# Altium schematic sheet SoundChip.SchDoc
size A
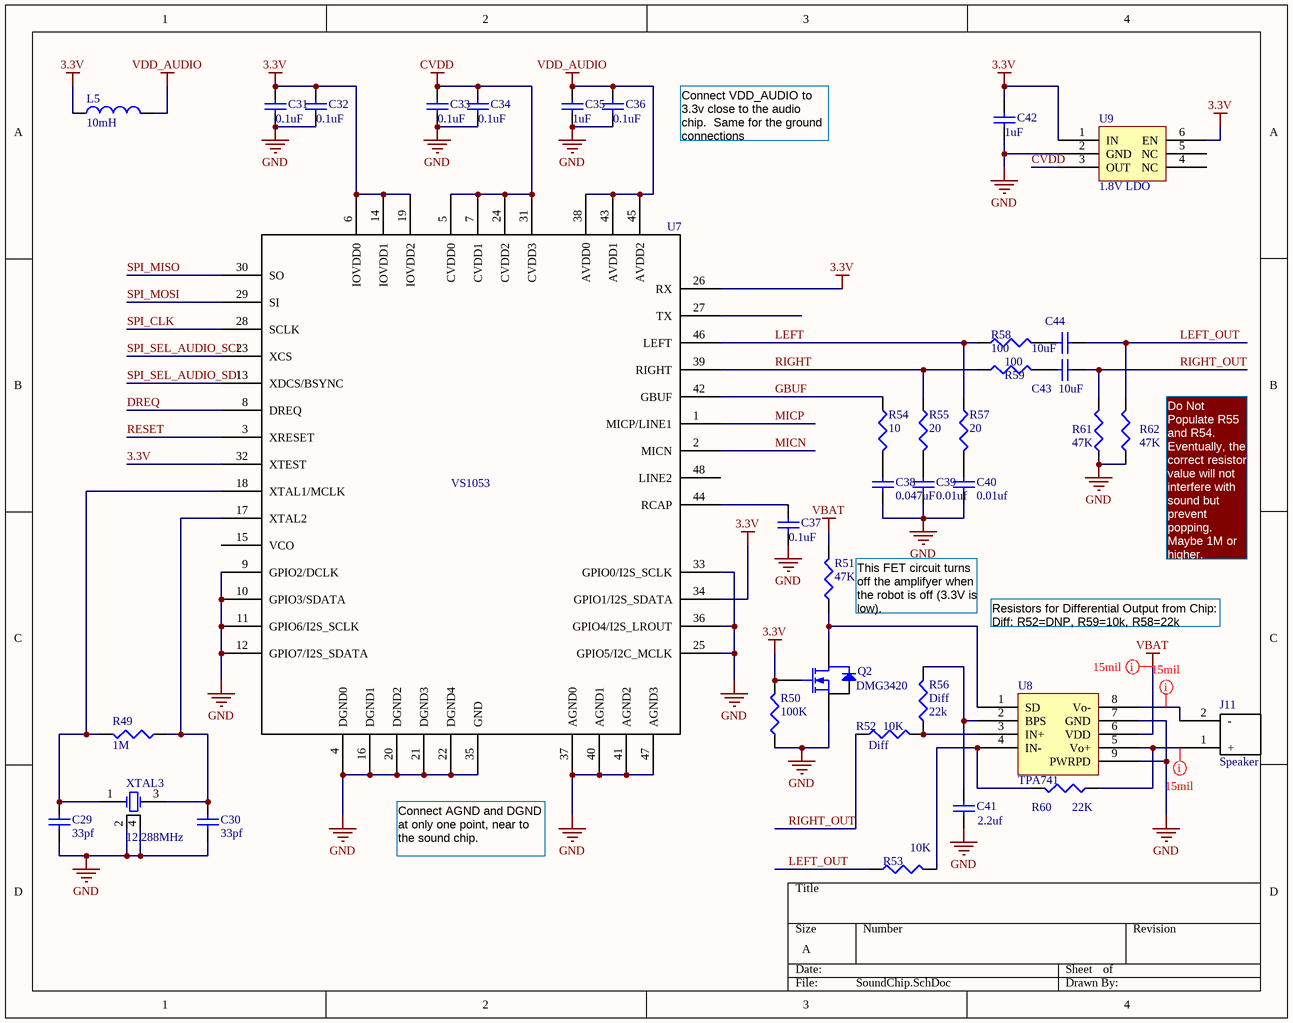
[diagram p0: SoundChip.SchDoc]

## Parts
C29  value 33pf  [CAPC1005L]  (hidden comment: Cap Semi)
C30  value 33pf  [CAPC1005L]  (hidden comment: Cap Semi)
C31  value 0.1uF  [CAPC1005L]  (hidden comment: Cap Semi)
C32  value 0.1uF  [CAPC1005L]  (hidden comment: Cap Semi)
C33  value 0.1uF  [CAPC1005L]  (hidden comment: Cap Semi)
C34  value 0.1uF  [CAPC1005L]  (hidden comment: Cap Semi)
C35  value 1uF  [CAPC1608L]  (hidden comment: Cap Semi)
C36  value 0.1uF  [CAPC1005L]  (hidden comment: Cap Semi)
C37  value 0.1uF  [CAPC1005L]  (hidden comment: Cap Semi)
C38  value 0.047uF  [CAPC1005L]  (hidden comment: Cap Semi)
C39  value 0.01uf  [CAPC1005L]  (hidden comment: Cap Semi)
C40  value 0.01uf  [CAPC1005L]  (hidden comment: Cap Semi)
C41  value 2.2uf  [J1-0603]  (hidden comment: Cap Semi)
C42  value 1uF  [CAPC1608L]  (hidden comment: Cap Semi)
C43  value 10uF  [CAPC1608L]  (hidden comment: Cap Semi)
C44  value 10uF  [CAPC1608L]  (hidden comment: Cap Semi)
J11  Speaker  [BatteryConnJST]
L5  value 10mH  [INDC2012L]  (hidden comment: Inductor)
Q2  MPN: DMG3420  [SOT-23]  (hidden comment: N-Mosfet)
R49  value 1M  [RESC1608L]  (hidden comment: Res3)
R50  value 100K  [RESC1608L]  (hidden comment: Res3)
R51  value 47K  [J1-0603]  (hidden comment: Res3)
R52  Diff  value 10K  [RESC1608L]
R53  value 10K  [RESC1608L]  (hidden comment: Res3)
R54  value 10  [RESC1608L]  (hidden comment: Res3)
R55  value 20  [RESC1608L]  (hidden comment: Res3)
R56  Diff  value 22k  [RESC1608L]
R57  value 20  [RESC1608L]  (hidden comment: Res3)
R58  value 100  [RESC1608L]  (hidden comment: Res3)
R59  value 100  [RESC1608L]  (hidden comment: Res3)
R60  value 22K  [RESC1608L]  (hidden comment: Res3)
R61  value 47K  [RESC1608L]  (hidden comment: Res3)
R62  value 47K  [RESC1608L]  (hidden comment: Res3)
U7  VS1053  [LQFP-48]
U8  TPA741  [audio amp]
U9  1.8V LDO  [WFDFN-6]
XTAL3  12.288MHz  [CRYSTAL]

## Nets
3.3V: C31.2 C32.2 C42.1 L5.2 Q2.1(G) R50.2 U7.6(IOVDD0) U7.14(IOVDD1) U7.19(IOVDD2) U7.26(RX) U7.32(XTEST) U7.34(GPIO1/I2S_SDATA) U9.1(IN) U9.6(EN)
CVDD: C33.2 C34.2 U7.5(CVDD0) U7.7(CVDD1) U7.24(CVDD2) U7.31(CVDD3) U9.3(OUT)
GND: C29.2 C30.2 C31.1 C32.1 C33.1 C34.1 C35.2 C36.1 C37.1 C38.2 C39.2 C40.2 C41.1 C42.2 Q2.2(S) R50.1 R61.1 R62.1 U7.4(DGND0) U7.9(GPIO2/DCLK) U7.10(GPIO3/SDATA) U7.11(GPIO6/I2S_SCLK) U7.12(GPIO7/I2S_SDATA) U7.16(DGND1) U7.20(DGND2) U7.21(DGND3) U7.22(DGND4) U7.25(GPIO5/I2C_MCLK) U7.33(GPIO0/I2S_SCLK) U7.35(GND) U7.36(GPIO4/I2S_LROUT) U7.37(AGND0) U7.40(AGND1) U7.41(AGND2) U7.47(AGND3) U8.7(GND) U8.9(PWRPD) U9.2(GND) XTAL3.2(GND) XTAL3.4(GND)
VBAT: R51.2 U8.6(VDD)
VDD_AUDIO: C35.1 C36.2 L5.1 U7.38(AVDD0) U7.43(AVDD1) U7.45(AVDD2)
DREQ: U7.8(DREQ)
GBUF: R54.1 U7.42(GBUF)
LEFT: R57.1 R58.1 U7.46(LEFT)
LEFT_OUT: C44.1 R53.1 R62.2
MICN: U7.2(MICN)
MICP: U7.1(MICP/LINE1)
RESET: U7.3(XRESET)
RIGHT: R55.1 R59.1 U7.39(RIGHT)
RIGHT_OUT: C43.1 R52.1 R61.2
SPI_CLK: U7.28(SCLK)
SPI_MISO: U7.30(SO)
SPI_MOSI: U7.29(SI)
SPI_SEL_AUDIO_SCI: U7.23(XCS)
SPI_SEL_AUDIO_SDI: U7.13(XDCS/BSYNC)
NetC29_1: C29.1 R49.2 U7.18(XTAL1/MCLK) XTAL3.1(OSC1)
NetC30_1: C30.1 R49.1 U7.17(XTAL2) XTAL3.3(OSC2)
NetC37_2: C37.2 U7.44(RCAP)
NetC38_1: C38.1 R54.2
NetC39_1: C39.1 R55.2
NetC40_1: C40.1 R57.2
NetC41_2: C41.2 R56.2 U8.2(BPS)
NetC43_2: C43.2 R59.2
NetC44_2: C44.2 R58.2
NetJ11_1: J11.1(+) R60.1 U8.5(Vo+)
NetJ11_2: J11.2(-) U8.8(Vo-)
NetQ2_3: Q2.3(D) R51.1 U8.1(SD)
NetR52_2: R52.2 R56.1 U8.3(IN+)
NetR53_2: R53.2 R60.2 U8.4(IN-)

Not connected (* = marked no-connect by the designer): U7 15(VCO) 27(TX) 48(LINE2); U9 4(NC) 5(NC)

## Layout directives
rule Width Constraint [Pref Width = 15mil    Min Width = 8mil    Max Width = 20mil]: NetJ11_1, NetJ11_2, VBAT

## Notes on the sheet
- Connect VDD_AUDIO to 3.3v close to the audio chip.  Same for the ground connections
- (near R62) Do Not Populate R55 and R54. Eventually, the correct resistor value will not interfere with sound but prevent popping. Maybe 1M or higher.
- (near R51) This FET circuit turns off the amplifyer when the robot is off (3.3V is low).
- Resistors for Differential Output from Chip:
  Diff: R52=DNP, R59=10k, R58=22k
- Connect AGND and DGND at only one point, near to the sound chip.

## Library data of the parts
C29-C44 = Cap Semi: Capacitor (Semiconductor SIM Model); Published: 8-Jun-2000; LatestRevisionDate: 29-May-2009; LatestRevisionNote: IPC-7351 Footprint Added.; PackageReference: C1206; Publisher: Altium Limited; PackageDescription: Chip Capacitor
J11 = BatteryConnJST
L5 = Inductor: Code_IEC: 1005; Published: 8-Jun-2000; LatestRevisionDate: 29-May-2009; LatestRevisionNote: IPC-7351 Footprint Added.; PackageReference: 0402-A; Publisher: Altium Limited; PackageDescription: Chip Inductor; Code_JEITA: 0402
R49-R62 = Res3: Resistor; Published: 8-Jun-2000; LatestRevisionDate: 29-May-2009; LatestRevisionNote: IPC-7351 Footprint Added.; PackageReference: J1-0603; Publisher: Altium Limited; PackageDescription: Chip Resistor
U8 = Audio Amp TPA741
U9 = 1.8V_LDO
XTAL3 = Crystal